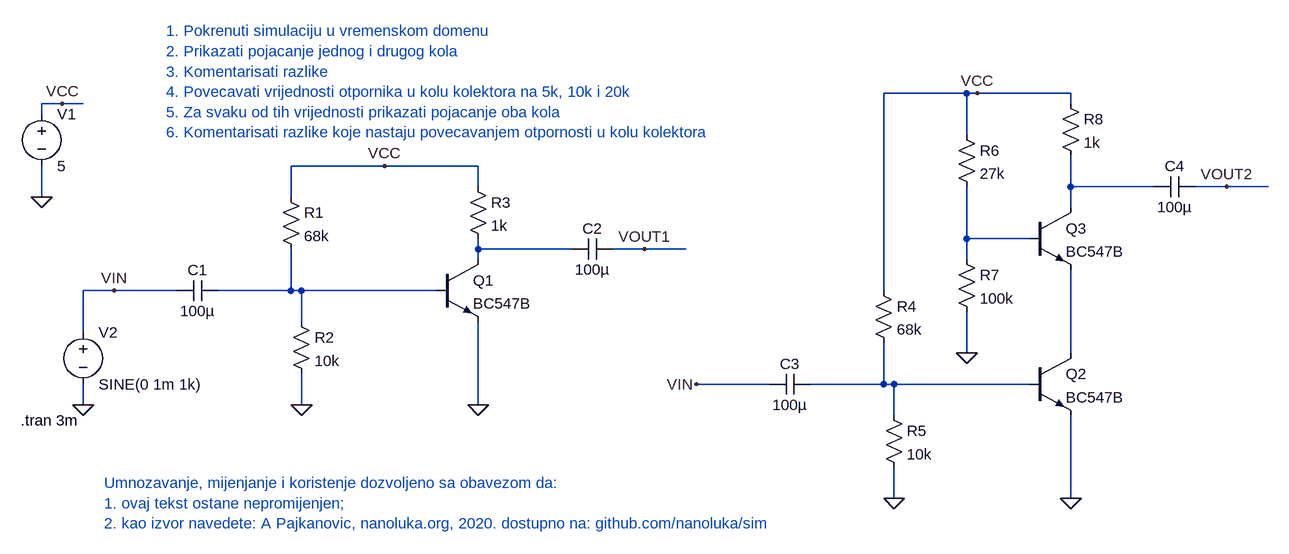
[diagram p0: schematic 02_pojacanje_ZE-KSK.asc]
02_pojacanje_ZE-KSK.asc, the LTspice schematic file:
Version 4
SHEET 1 1688 680
WIRE 1040 -96 912 -96
WIRE 1056 -96 1040 -96
WIRE 1200 -96 1056 -96
WIRE -352 -80 -384 -80
WIRE -320 -80 -352 -80
WIRE 1200 -80 1200 -96
WIRE -384 -64 -384 -80
WIRE 1040 -32 1040 -96
WIRE 144 16 0 16
WIRE 288 16 144 16
WIRE 288 48 288 16
WIRE 1200 48 1200 0
WIRE 1328 48 1200 48
WIRE 1440 48 1392 48
WIRE 1504 48 1440 48
WIRE -384 64 -384 16
WIRE 0 64 0 16
WIRE 1200 80 1200 48
WIRE 1040 128 1040 48
WIRE 1136 128 1040 128
WIRE 288 144 288 128
WIRE 432 144 288 144
WIRE 544 144 496 144
WIRE 608 144 544 144
WIRE 288 160 288 144
WIRE 1040 160 1040 128
WIRE -272 208 -320 208
WIRE -176 208 -272 208
WIRE 0 208 0 144
WIRE 0 208 -112 208
WIRE 16 208 0 208
WIRE 224 208 16 208
WIRE 912 208 912 -96
WIRE 16 256 16 208
WIRE -320 272 -320 208
WIRE 1040 304 1040 240
WIRE 1200 304 1200 176
WIRE 736 352 624 352
WIRE 912 352 912 288
WIRE 912 352 800 352
WIRE 928 352 912 352
WIRE 1136 352 928 352
WIRE -320 384 -320 352
WIRE 16 384 16 336
WIRE 288 384 288 256
WIRE 928 400 928 352
WIRE 928 528 928 480
WIRE 1200 528 1200 400
FLAG -384 64 0
FLAG 16 384 0
FLAG 288 384 0
FLAG -320 384 0
FLAG -352 -80 VCC
FLAG 144 16 VCC
FLAG -272 208 VIN
FLAG 544 144 VOUT1
FLAG 928 528 0
FLAG 1200 528 0
FLAG 1056 -96 VCC
FLAG 1440 48 VOUT2
FLAG 624 352 VIN
FLAG 1040 304 0
DATAFLAG 1072 128 ""
DATAFLAG 1264 48 ""
SYMBOL res -16 48 R0
SYMATTR InstName R1
SYMATTR Value 68k
SYMBOL res 0 240 R0
SYMATTR InstName R2
SYMATTR Value 10k
SYMBOL npn 224 160 R0
SYMATTR InstName Q1
SYMATTR Value BC547B
SYMBOL cap -112 192 R90
WINDOW 0 0 32 VBottom 2
WINDOW 3 32 32 VTop 2
SYMATTR InstName C1
SYMATTR Value 100µ
SYMBOL voltage -384 -80 R0
WINDOW 123 0 0 Left 2
WINDOW 39 0 0 Left 2
SYMATTR InstName V1
SYMATTR Value 5
SYMBOL voltage -320 256 R0
WINDOW 123 0 0 Left 2
WINDOW 39 0 0 Left 2
SYMATTR InstName V2
SYMATTR Value SINE(0 1m 1k)
SYMBOL cap 496 128 R90
WINDOW 0 0 32 VBottom 2
WINDOW 3 32 32 VTop 2
SYMATTR InstName C2
SYMATTR Value 100µ
SYMBOL res 272 32 R0
SYMATTR InstName R3
SYMATTR Value 1k
SYMBOL res 896 192 R0
SYMATTR InstName R4
SYMATTR Value 68k
SYMBOL res 912 384 R0
SYMATTR InstName R5
SYMATTR Value 10k
SYMBOL npn 1136 304 R0
SYMATTR InstName Q2
SYMATTR Value BC547B
SYMBOL cap 800 336 R90
WINDOW 0 0 32 VBottom 2
WINDOW 3 32 32 VTop 2
SYMATTR InstName C3
SYMATTR Value 100µ
SYMBOL cap 1392 32 R90
WINDOW 0 0 32 VBottom 2
WINDOW 3 32 32 VTop 2
SYMATTR InstName C4
SYMATTR Value 100µ
SYMBOL npn 1136 80 R0
SYMATTR InstName Q3
SYMATTR Value BC547B
SYMBOL res 1024 -48 R0
SYMATTR InstName R6
SYMATTR Value 27k
SYMBOL res 1024 144 R0
SYMATTR InstName R7
SYMATTR Value 100k
SYMBOL res 1184 -96 R0
SYMATTR InstName R8
SYMATTR Value 1k
TEXT -416 408 Left 2 !.tran 3m
TEXT -192 -192 Left 2 ;1. Pokrenuti simulaciju u vremenskom domenu\n2. Prikazati pojacanje jednog i drugog kola\n3. Komentarisati razlike\n4. Povecavati vrijednosti otpornika u kolu kolektora na 5k, 10k i 20k\n5. Za svaku od tih vrijednosti prikazati pojacanje oba kola\n6. Komentarisati razlike koje nastaju povecavanjem otpornosti u kolu kolektora
TEXT -288 504 Left 2 ;Umnozavanje, mijenjanje i koristenje dozvoljeno sa obavezom da:\n1. ovaj tekst ostane nepromijenjen;\n2. kao izvor navedete: A Pajkanovic, nanoluka.org, 2020. dostupno na: github.com/nanoluka/sim

The netlist it stands for:
* 02_pojacanje_ZE-KSK.asc
R1 VCC N004 68k
R2 N004 0 10k
Q1 N003 N004 0 0 BC547B
C1 N004 VIN 100µ
V1 VCC 0 5
V2 VIN 0 SINE(0 1m 1k)
C2 VOUT1 N003 100µ
R3 VCC N003 1k
R4 VCC N006 68k
R5 N006 0 10k
Q2 N005 N006 0 0 BC547B
C3 N006 VIN 100µ
C4 VOUT2 N001 100µ
Q3 N001 N002 N005 0 BC547B
R6 VCC N002 27k
R7 N002 0 100k
R8 VCC N001 1k
.model NPN NPN
.model PNP PNP
.lib standard.bjt
.tran 3m
* 1. Pokrenuti simulaciju u vremenskom domenu
* 2. Prikazati pojacanje jednog i drugog kola
* 3. Komentarisati razlike
* 4. Povecavati vrijednosti otpornika u kolu kolektora na 5k, 10k i 20k
* 5. Za svaku od tih vrijednosti prikazati pojacanje oba kola
* 6. Komentarisati razlike koje nastaju povecavanjem otpornosti u kolu kolektora
* Umnozavanje, mijenjanje i koristenje dozvoljeno sa obavezom da:
* 1. ovaj tekst ostane nepromijenjen;
* 2. kao izvor navedete: A Pajkanovic, nanoluka.org, 2020. dostupno na: github.com/nanoluka/sim
.backanno
.end